# EAGLE schematic h-bridge (EAGLE 6.6.0)
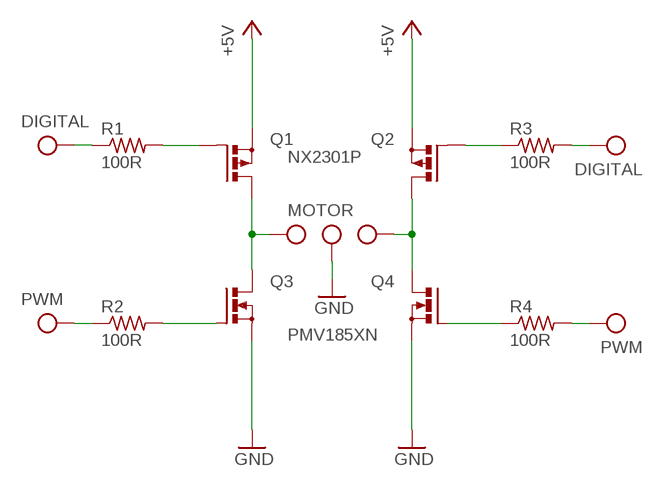
[diagram p0: schematic, sheet 1]

## Parts
Q1  PMOSFET_PTO220BH  [TO220BH]
Q2  PMOSFET_PTO220BH  [TO220BH]
Q3  PMOSFET_NTO220BH  [TO220BH]
Q4  PMOSFET_NTO220BH  [TO220BH]
R1  100R  R-US_0204/2V  [0204V]
R2  100R  R-US_0204/2V  [0204V]
R3  100R  R-US_0204/2V  [0204V]
R4  100R  R-US_0204/2V  [0204V]

## Nets
+5V: Q1.S Q2.S
CON: Q1.D Q2.D Q3.D Q4.D R1.1 R2.1 R3.2 R4.2 ; supply symbol labelled DIGITAL, PWM, GND
GND: Q3.S Q4.S
N$1: Q1.G R1.2
N$2: Q3.G R2.2
N$5: Q2.G R3.1
N$6: Q4.G
Unconnected: R4.1

## Notes on the sheet
- NX2301P
- MOTOR
- PMV185XN

## Library data of the parts
Q1 Q2 = transistor-power:PMOSFET_P: Power MOSFET P-Channel
Q3 Q4 = transistor-power:PMOSFET_N: Power MOSFET N-Channel
R1-R4 = resistor:R-US_: RESISTOR, American symbol